# EAGLE design untitled (EAGLE 7.1.0)
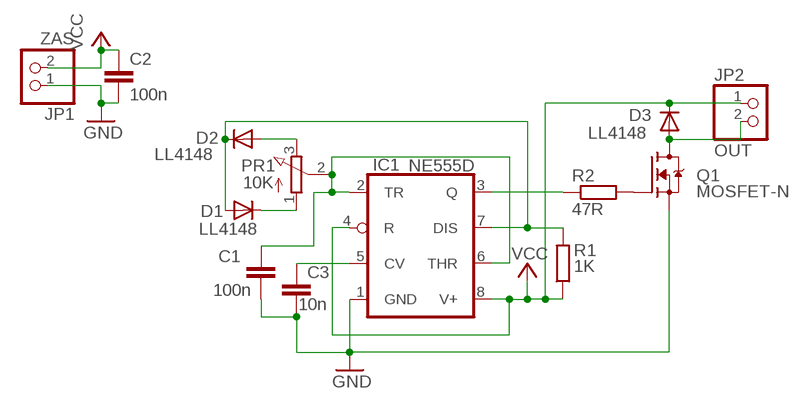
[diagram p0: schematic, sheet 1]

## Parts
C1  100n  C-EUC0603  [C0603]
C2  100n  C-EUC1206  [C1206]
C3  10n  C-EUC0603  [C0603]
D1  LL4148  DIODE-MINIMELF  [MINIMELF]
D2  LL4148  DIODE-MINIMELF  [MINIMELF]
D3  LL4148  DIODE-MINIMELF  [MINIMELF]
IC1  NE555D  [SO08]
JP1  ZAS  PINHD-1X2  [1X02]
JP2  OUT  PINHD-1X2  [1X02]
PR1  10K  3RP/1610N  [3RP/1610N]
Q1  MOSFET-N  [TO252]
R1  1K  R-EU_R0603  [R0603]
R2  47R  R-EU_R0603  [R0603]

## Nets
GND: C1.2 C2.2 C3.2 IC1.1(GND) JP1.1 Q1.2(S)
N$1: C1.1 IC1.2(TR) IC1.6(THR) PR1.2(S)
N$2: D1.C PR1.1(A)
N$3: D2.A PR1.3(E)
N$5: D1.A D2.C IC1.7(DIS) R1.2
N$6: IC1.3(Q) R2.1
N$7: Q1.1(G) R2.2
N$9: C3.1 IC1.5(CV)
N$11: D3.A JP2.2 Q1.3(D)
VCC: C2.1 D3.C IC1.4(R) IC1.8(V+) JP1.2 JP2.1 R1.1

## Library data of the parts
C1-C3 = rcl:C-EU: CAPACITOR, European symbol
D1-D3 = diode:DIODE-: DIODE
IC1 = adafruit:*555: TIMER Changed DIP package to have round (not oval) pin pads http://www.ladyada.net/library/pcb/eaglelibrary.html
JP1 JP2 = pinhead:PINHD-1X2: PIN HEADER
PR1 = pot:3RP/1610N: 16mm Potentiometer one level Source: http://www.alphapotentiometers.net/html/16mm_pot_2.html
Q1 = mosfet_to252:MOSFET-N
R1 R2 = rcl:R-EU_: RESISTOR, European symbol

## Board
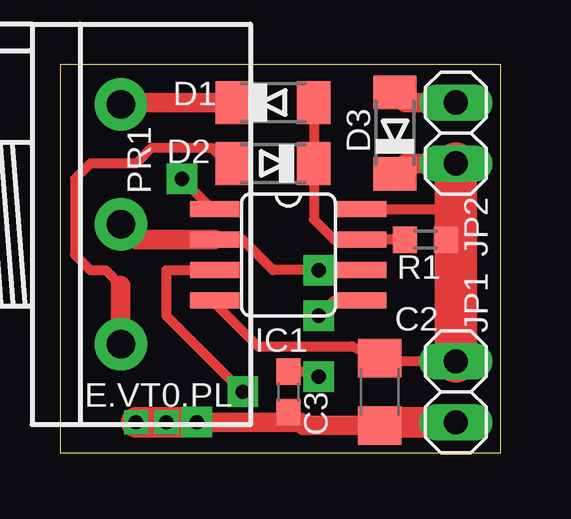
[diagram p1: board, top side]
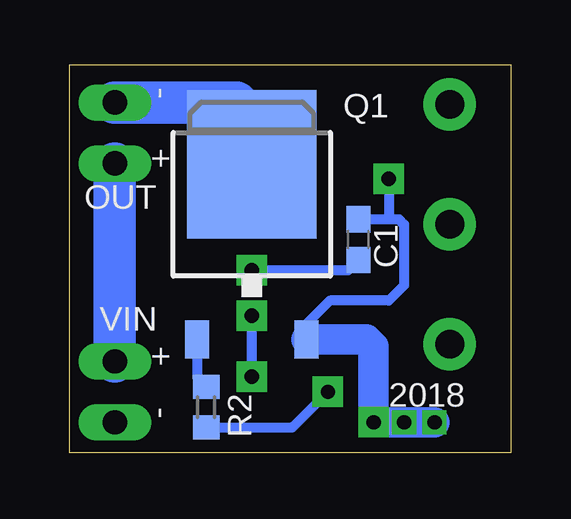
[diagram p2: board, bottom side, seen from below]

Size 18.39 x 16.18 mm. Coordinates in mm from the lower left corner, seen from the top.
Outline: 0,0 18.39,0 18.39,16.18 0,16.18 0,0
Copper layers (1*16): Top 0.035mm / dielectric 1.5mm / Bottom 0.035mm
Design rules "satland.v1": minimum track width 8mil, minimum drill 12mil, track to track 8mil, track to pad 8mil, pad to pad 8mil, via to via 8mil, smd to smd 0mil, copper to edge 8mil, drill to drill 8mil, minimum pad ring 8mil, minimum via ring 8mil, stop-mask expansion 2mil, vias tented up to drill 25mil, thermal gap 10mil

### Footprints (pad centres in the part's own frame; a part is rotated, then mirrored left to right if it is on the bottom)
C0603 = smd 1.1 x 1: 1 -0.85,0; 2 0.85,0
C1206 = smd 1.6 x 1.8: 1 -1.4,0; 2 1.4,0
MINIMELF = smd 1.4 x 1.8: A 1.7,0; C -1.7,0
SO08 = smd 0.66 x 2.032: 1 -1.905,-3.073; 2 -0.635,-3.073; 3 0.635,-3.073; 4 1.905,-3.073; 5 1.905,3.073; 6 0.635,3.073; 7 -0.635,3.073; 8 -1.905,3.073
1X02 = drill 1.016 long: 1 -1.27,0; 2 1.27,0
3RP/1610N = drill 1.2 pad 2.184: 1 -5,0; 2 0,0; 3 5,0
TO252 = smd 1 x 1.6: 1 -2.28,-4.8; 2 2.28,-4.8 | smd 5.4 x 6.2: 3 0,2.5
R0603 = smd 1 x 1.1: 1 -0.85,0; 2 0.85,0

### Placement (x,y rotation side)
C1  6.35,8.89 90 bottom
C2  13.33,2.54 270 top
C3  9.52,2.54 270 top
D1  8.89,14.61 0 top
D2  8.89,12.07 180 top
D3  13.97,13.34 90 top
IC1  9.52,8.26 270 top
JP1  16.51,2.54 90 top
JP2  16.51,13.34 90 top
PR1  2.54,9.53 270 top
Q1  10.79,9.53 0 bottom
R1  15.24,8.89 180 top
R2  12.7,1.91 90 bottom

### Tracks (layer width: path | path; a pad name or v marks a point on that pad's centre or on a via)
GND  (via drill 0.6, 0.6 pad 1.27)
  Top 0.406: C3.2 10.07,1.14 10.16,1.14 10.03,1.27 | IC1.1 6.35,10.16 v5.08,11.43
  Top 0.813: C2.2 10.16,1.14 | v5.71,1.27 10.03,1.27
  Top 1.27: JP1.1 13.46,1.27 C2.2 | v5.71,1.27 v4.45,1.27 v3.17,1.27
  Bottom 0.406: C1.2 5.08,9.74 | 5.08,9.74 4.66,9.74 4.45,9.53 4.45,6.99 5.08,6.35 7.54,6.35 8.52,5.37 Q1.2 | v5.08,11.43 5.08,9.74
  Bottom 1.27: Q1.2 6.01,4.74 5.71,4.44 v5.71,1.27 v4.45,1.27 v3.17,1.27
N$1  (via drill 0.6 pad 1.27)
  Top 0.406: IC1.2 7.62,8.89 8.89,7.62 v10.79,7.62 IC1.6
  Top 0.813: IC1.2 3.17,8.89 PR1.2
  Bottom 0.406: v10.79,7.62 6.77,7.62 C1.1
N$2
  Top 0.813: D1.C 2.62,14.61 PR1.1
N$3
  Top 0.406: D2.A 6.98,12.07 6.35,12.7 3.81,12.7 3.17,12.07 1.27,12.07 0.63,11.43 0.63,8.26 1.27,7.62 1.9,7.62 2.54,6.99
  Top 0.813: 2.54,6.99 PR1.3
N$5
  Top 0.406: R1.2 IC1.7 11.43,8.89 10.59,9.73 D2.C D1.A
N$6  (via drill 0.6 pad 1.27)
  Top 0.406: v7.62,2.54 4.45,5.71 4.45,7.62 IC1.3
  Bottom 0.406: R2.1 9.11,1.05 v7.62,2.54
N$7
  Bottom 0.406: Q1.1 13.07,3.13 R2.2
N$9  (via drill 0.6 pad 1.27)
  Top 0.406: C3.1 10.38,3.39 v10.79,3.17 | v10.79,5.71 11.43,6.35 IC1.5
  Bottom 0.406: v10.79,3.17 v10.79,5.71
N$11
  Top 0.406: 14.4,14.61 D3.A
  Top 0.813: JP2.2 14.4,14.61
  Bottom 1.778: Q1.3 10.79,13.97 11.43,14.61 JP2.2
VCC
  Top 0.406: IC1.8 15.88,10.16 16.51,9.53 | IC1.4 6.45,6.25 8.25,4.44 12.2,4.44 C2.1 13.46,3.81 JP1.2 | 14.4,12.07 D3.C | R1.1 16.09,8.68 16.51,8.26
  Top 0.813: JP2.1 14.4,12.07
  Top 1.778: JP1.2 16.51,8.26 16.51,9.53 JP2.1
  Bottom 1.778: JP1.2 JP2.1

### Text on the board
tNames: E.VT0.PL
bNames: - | + | OUT | VIN | + | 2018 | -